# Altium schematic sheet Gate Drive.SchDoc
size 431 x 279 mm; Organization: ORGANIZATION; Address1: ADDRESS 1; Address2: ADDRESS 2; Address3: ADDRESS 3; Address4: ADDRESS 4; DocumentNumber: 1; SheetNumber: 2; SheetTotal: 6
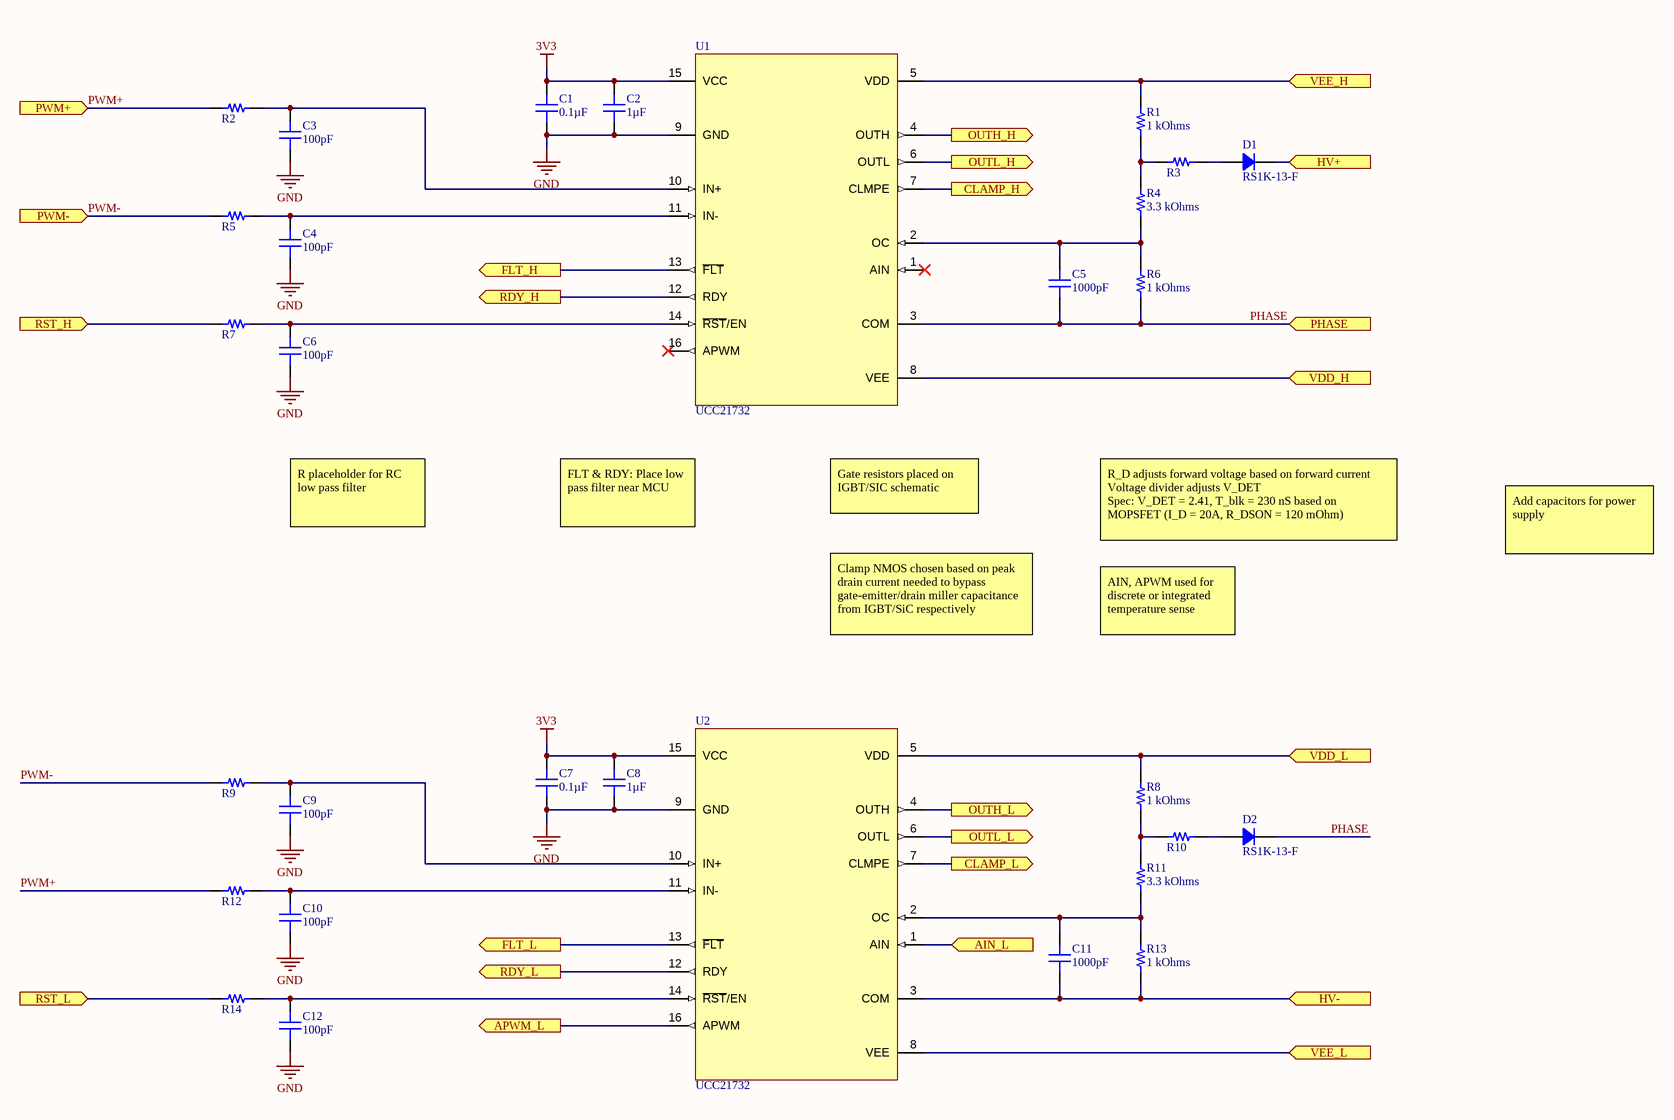
[diagram p0: Gate Drive.SchDoc]

## Parts
C1  0.1µF  [CAP 0805_2012]
C2  1µF  [CAP 0805_2012]
C3  100pF  [CAP 0805_2012]
C4  100pF  [CAP 0805_2012]
C5  1000pF  [CAP 0805_2012]
C6  100pF  [CAP 0805_2012]
C7  0.1µF  [CAP 0805_2012]
C8  1µF  [CAP 0805_2012]
C9  100pF  [CAP 0805_2012]
C10  100pF  [CAP 0805_2012]
C11  1000pF  [CAP 0805_2012]
C12  100pF  [CAP 0805_2012]
D1  RS1K-13-F  [DO214AC SMA]
D2  RS1K-13-F  [DO214AC SMA]
R1  1 kOhms  [RES 0805_2012]
R2  (no value)  [RES 0805_2012]
R3  (no value)  [RES 0805_2012]
R4  3.3 kOhms  [RES 0805_2012]
R5  (no value)  [RES 0805_2012]
R6  1 kOhms  [RES 0805_2012]
R7  (no value)  [RES 0805_2012]
R8  1 kOhms  [RES 0805_2012]
R9  (no value)  [RES 0805_2012]
R10  (no value)  [RES 0805_2012]
R11  3.3 kOhms  [RES 0805_2012]
R12  (no value)  [RES 0805_2012]
R13  1 kOhms  [RES 0805_2012]
R14  (no value)  [RES 0805_2012]
U1  UCC21732
U2  UCC21732

## Ports
AIN_L (in), APWM_L (out), CLAMP_H (out), CLAMP_L (out), FLT_H (out), FLT_L (out), HV+ (in), HV- (in), OUTH_H (out), OUTH_L (out), OUTL_H (out), OUTL_L (out), PHASE (in), PWM+ (in), PWM- (in), RDY_H (out), RDY_L (out), RST_H (in), RST_L (in), VDD_H (in), VDD_L (in), VEE_H (in), VEE_L (in)

## Nets
3V3: C1.2 C2.2 C7.2 C8.2 U1.15(VCC) U2.15(VCC)
GND: C1.1 C2.1 C3.1 C4.1 C6.1 C7.1 C8.1 C9.1 C10.1 C12.1 U1.9(GND) U2.9(GND)
AIN_L: U2.1(AIN) ; port AIN_L
APWM_L: U2.16(APWM) ; port APWM_L
CLAMP_H: U1.7(CLMPE) ; port CLAMP_H
CLAMP_L: U2.7(CLMPE) ; port CLAMP_L
FLT_H: U1.13(~{FLT}) ; port FLT_H
FLT_L: U2.13(~{FLT}) ; port FLT_L
HV+: D1.2 ; port HV+
HV-: C11.1 R13.1 U2.3(COM) ; port HV-
OUTH_H: U1.4(OUTH) ; port OUTH_H
OUTH_L: U2.4(OUTH) ; port OUTH_L
OUTL_H: U1.6(OUTL) ; port OUTL_H
OUTL_L: U2.6(OUTL) ; port OUTL_L
PHASE: C5.1 D2.2 R6.1 U1.3(COM) ; port PHASE
PWM+: R2.1 R12.1 ; port PWM+
PWM-: R5.1 R9.1 ; port PWM-
RDY_H: U1.12(RDY) ; port RDY_H
RDY_L: U2.12(RDY) ; port RDY_L
RST_H: R7.1 ; port RST_H
RST_L: R14.1 ; port RST_L
VDD_H: U1.8(VEE) ; port VDD_H
VDD_L: R8.2 U2.5(VDD) ; port VDD_L
VEE_H: R1.2 U1.5(VDD) ; port VEE_H
VEE_L: U2.8(VEE) ; port VEE_L
NetC3_2: C3.2 R2.2 U1.10(IN+)
NetC4_2: C4.2 R5.2 U1.11(IN-)
NetC5_2: C5.2 R4.1 R6.2 U1.2(OC)
NetC6_2: C6.2 R7.2 U1.14(~{RST}/EN)
NetC9_2: C9.2 R9.2 U2.10(IN+)
NetC10_2: C10.2 R12.2 U2.11(IN-)
NetC11_2: C11.2 R11.1 R13.2 U2.2(OC)
NetC12_2: C12.2 R14.2 U2.14(~{RST}/EN)
NetD1_1: D1.1 R3.2
NetD2_1: D2.1 R10.2
NetR1_1: R1.1 R3.1 R4.2
NetR8_1: R8.1 R10.1 R11.2

Not connected (* = marked no-connect by the designer): U1 1(AIN)* 16(APWM)*

## Notes on the sheet
- R placeholder for RC low pass filter
- FLT & RDY: Place low pass filter near MCU
- Gate resistors placed on IGBT/SIC schematic
- R_D adjusts forward voltage based on forward current
  Voltage divider adjusts V_DET
  Spec: V_DET = 2.41, T_blk = 230 nS based on MOPSFET (I_D = 20A, R_DSON = 120 mOhm)
- Add capacitors for power supply
- Clamp NMOS chosen based on peak drain current needed to bypass gate-emitter/drain miller capacitance from IGBT/SiC respectively
- AIN, APWM used for discrete or integrated temperature sense
- Title
- Project
- Scale
- Size
- B
- Part Number
- Engineer
- Sheet
- of
- Rev

## Library data of the parts
C1 C7 = CGA4J2X7R2A104K125AE: CAP CER 0.1UF 100V X7R 0805; Manufacturer: TDK Corporation; Tolerance: ±10%; Part Number: CGA4J2X7R2A104K125AE; Value: 0.1µF; Applications: Automotive, Boardflex Sensitive; Capacitance: 0.1µF; ComponentLink1Description: Datasheet; ComponentLink1URL: https://product.tdk.com/info/en/catalog/datasheets/mlcc_automotive_soft_en.pdf?ref_disty=digikey; ComponentLink2Description: DigiKey Link; ComponentLink2URL: http://digikey.com/product-detail/en/tdk-corporation/CGA4J2X7R2A104K125AE/445-15961-1-ND/4490669; Device Package: 0805 (2012 Metric); Features: Soft Termination; LastUpdated: 9/2/2020 1:04:19 AM; Lifecycle Status: Active; Minimum Order: 1; Mounting Type: Surface Mount, MLCC; Operating Temperature: -55°C ~ 125°C; Package / Case: 0805 (2012 Metric); Packaging: TapeAndReel; PartId: 14432; Part Status: Active; Price: 0.07; Ratings: AEC-Q200; Series: CGA; Size / Dimension: 0.079" L x 0.049" W (2.00mm x 1.25mm); Supplier 1: DigiKey; Supplier Part Number 1: 445-15961-1-ND; Temperature Coefficient: X7R; Thickness (Max): 0.057" (1.45mm); Voltage - Rated: 100V
C2 C8 = CGA4J3X7R1E105K125AD: CAP CER 1UF 25V X7R 0805 EPOXY; Manufacturer: TDK Corporation; Tolerance: ±10%; Part Number: CGA4J3X7R1E105K125AD; Value: 1µF; Applications: Automotive; Capacitance: 1µF; ComponentLink1Description: Datasheet; ComponentLink1URL: https://product.tdk.com/info/en/catalog/datasheets/mlcc_automotive_epoxy_en.pdf?ref_disty=digikey; ComponentLink2Description: DigiKey Link; ComponentLink2URL: http://digikey.com/product-detail/en/tdk-corporation/CGA4J3X7R1E105K125AD/445-8811-1-ND/3248259; Device Package: 0805 (2012 Metric); Features: Epoxy Mountable; LastUpdated: 9/2/2020 1:04:19 AM; Lifecycle Status: Active; Minimum Order: 1; Mounting Type: Surface Mount, MLCC, Epoxy; Operating Temperature: -55°C ~ 125°C; Package / Case: 0805 (2012 Metric); Packaging: TapeAndReel; PartId: 14482; Part Status: Active; Price: 0.09; Ratings: AEC-Q200; Series: CGA; Size / Dimension: 0.079" L x 0.049" W (2.00mm x 1.25mm); Supplier 1: DigiKey; Supplier Part Number 1: 445-8811-1-ND; Temperature Coefficient: X7R; Thickness (Max): 0.057" (1.45mm); Voltage - Rated: 25V
C3 C4 C6 C9 C10 C12 = C0805C101K3RAC7800: CAP CER 100PF 25V X7R 0805; Manufacturer: KEMET; Tolerance: ±10%; Part Number: C0805C101K3RAC7800; Value: 100pF; Applications: Bypass, Decoupling; Capacitance: 100pF; ComponentLink1Description: Datasheet; ComponentLink1URL: https://api.kemet.com/component-edge/download/datasheet/C0805C101K3RAC7800.pdf; ComponentLink2Description: DigiKey Link; ComponentLink2URL: http://digikey.com/product-detail/en/kemet/C0805C101K3RAC7800/399-15002-1-ND/7382551; Device Package: 0805 (2012 Metric); LastUpdated: 9/2/2020 1:04:39 AM; Lifecycle Status: Active; Minimum Order: 1; Mounting Type: Surface Mount, MLCC; Operating Temperature: -55°C ~ 125°C; Package / Case: 0805 (2012 Metric); Packaging: TapeAndReel; PartId: 3885; Part Status: Active; Price: 0.05; Series: SMD Comm X7R; Size / Dimension: 0.079" L x 0.049" W (2.00mm x 1.25mm); Supplier 1: DigiKey; Supplier Part Number 1: 399-15002-1-ND; Temperature Coefficient: X7R; Thickness (Max): 0.035" (0.88mm); Voltage - Rated: 25V
C5 C11 = C0805C102J5RACTU: CAP CER 1000PF 50V X7R 0805; Manufacturer: KEMET; Tolerance: ±5%; Part Number: C0805C102J5RACTU; Value: 1000pF; Applications: Bypass, Decoupling; Capacitance: 1000pF; ComponentLink1Description: Datasheet; ComponentLink1URL: https://api.kemet.com/component-edge/download/datasheet/C0805C102J5RACTU.pdf; ComponentLink2Description: DigiKey Link; ComponentLink2URL: http://digikey.com/product-detail/en/kemet/C0805C102J5RACTU/399-1149-1-ND/411424; Device Package: 0805 (2012 Metric); LastUpdated: 9/2/2020 1:04:42 AM; Lifecycle Status: Active; Minimum Order: 1; Mounting Type: Surface Mount, MLCC; Operating Temperature: -55°C ~ 125°C; Package / Case: 0805 (2012 Metric); Packaging: TapeAndReel; PartId: 2505; Part Status: Active; Price: 0.02; Series: SMD Comm X7R; Size / Dimension: 0.079" L x 0.049" W (2.00mm x 1.25mm); Supplier 1: DigiKey; Supplier Part Number 1: 399-1149-1-ND; Temperature Coefficient: X7R; Thickness (Max): 0.035" (0.88mm); Voltage - Rated: 50V
D1 D2 = RS1K-13-F: DIODE GEN PURP 800V 1A SMA; Manufacturer: Diodes Incorporated; Capacitance @ Vr, F: 15pF @ 4V, 1MHz; Current - Reverse Leakage @ Vr: 5µA @ 800V; Diode Type: Standard; Reverse Recovery Time (trr): 500ns; Speed: Fast Recovery =< 500ns, > 200mA (Io); Voltage - Forward (Vf) (Max) @ If: 1.3V @ 1A; Part Number: RS1K-13-F; ComponentLink1Description: Datasheet; ComponentLink1URL: https://www.diodes.com/assets/Datasheets/ds15002.pdf; ComponentLink2Description: DigiKey Link; ComponentLink2URL: http://digikey.com/product-detail/en/diodes-incorporated/RS1K-13-F/RS1K-FDICT-ND/750029; Current - Average Rectified (Io): 1A; LastUpdated: 9/2/2020 1:19:04 AM; Lifecycle Status: Active; Minimum Order: 1; Mounting Type: Surface Mount; Operating Temperature - Junction: -65°C ~ 150°C; Package / Case: DO-214AC, SMA; Packaging: TapeAndReel; PartId: 637; Part Status: Active; Price: 0.10; Series: -; Supplier 1: DigiKey; Supplier Part Number 1: RS1K-FDICT-ND; Supplier Device Package: SMA; Voltage - DC Reverse (Vr) (Max): 800V
R1 R6 R8 R13 = CRCW08051K00JNEAHP: RES SMD 1K OHM 5% 1/2W 0805; Manufacturer: Vishay Dale; Power (Watts): 0.5W, 1/2W; Temperature Coefficient: ±200ppm/°C; Part Number: CRCW08051K00JNEAHP; Value: 1 kOhms; ComponentLink1Description: Datasheet; ComponentLink1URL: http://www.vishay.com/docs/20043/crcwhpe3.pdf; ComponentLink2Description: DigiKey Link; ComponentLink2URL: http://digikey.com/product-detail/en/vishay-dale/CRCW08051K00JNEAHP/541-1.0KTACT-ND/2222900; Composition: Thick Film; Device Package: 0805 (2012 Metric); Features: Automotive AEC-Q200, Pulse Withstanding; Height - Seated (Max): 0.020" (0.50mm); LastUpdated: 9/2/2020 1:15:08 AM; Lifecycle Status: Active; Minimum Order: 1; Number of Terminations: 2; Operating Temperature: -55°C ~ 155°C; Package / Case: 0805 (2012 Metric); Packaging: TapeAndReel; PartId: 34827; Part Status: Active; Price: 0.02; Ratings: AEC-Q200; Resistance: 1 kOhms; Series: CRCW-HP; Size / Dimension: 0.079" L x 0.049" W (2.00mm x 1.25mm); Supplier 1: DigiKey; Supplier Part Number 1: 541-1.0KTACT-ND; Supplier Device Package: 0805; Tolerance: ±5%
R2 R3 R5 R7 R9 R10 R12 R14 = 5107: RES 0 OHM JUMPER 0805; Part Number: 5107; Manufacturer: Keystone Electronics; Power (Watts): 0.5W, 1/2W; ComponentLink1Description: Datasheet; ComponentLink1URL: http://www.keyelco.com/product-pdf.cfm?p=14350; ComponentLink2Description: DigiKey Link; ComponentLink2URL: http://digikey.com/product-detail/en/keystone-electronics/5107/36-5107CT-ND/7942984; Composition: Metal Element; Device Package: 0805 (2012 Metric); Height - Seated (Max): 0.033" (0.84mm); LastUpdated: 9/2/2020 1:14:45 AM; Lifecycle Status: Active; Minimum Order: 1; Number of Terminations: 2; Package / Case: 0805 (2012 Metric); Packaging: TapeAndReel; PartId: 45276; Part Status: Active; Price: 0.16; Series: -; Size / Dimension: 0.079" L x 0.049" W (2.00mm x 1.25mm); Supplier 1: DigiKey; Supplier Part Number 1: 36-5107CT-ND; Supplier Device Package: 0805; Tolerance: Jumper
R4 R11 = CRCW08053K30JNEA: RES SMD 3.3K OHM 5% 1/8W 0805; Manufacturer: Vishay Dale; Power (Watts): 0.125W, 1/8W; Temperature Coefficient: ±200ppm/°C; Part Number: CRCW08053K30JNEA; Value: 3.3 kOhms; ComponentLink1Description: Datasheet; ComponentLink1URL: http://www.vishay.com/docs/20035/dcrcwe3.pdf; ComponentLink2Description: DigiKey Link; ComponentLink2URL: http://digikey.com/product-detail/en/vishay-dale/CRCW08053K30JNEA/541-3.3KACT-ND/1180352; Composition: Thick Film; Device Package: 0805 (2012 Metric); Features: Automotive AEC-Q200; Height - Seated (Max): 0.020" (0.50mm); LastUpdated: 9/2/2020 1:14:52 AM; Lifecycle Status: Active; Minimum Order: 1; Number of Terminations: 2; Operating Temperature: -55°C ~ 155°C; Package / Case: 0805 (2012 Metric); Packaging: CutTape; PartId: 42029; Part Status: Active; Price: 0.10; Ratings: AEC-Q200; Resistance: 3.3 kOhms; Series: CRCW; Size / Dimension: 0.079" L x 0.049" W (2.00mm x 1.25mm); Supplier 1: DigiKey; Supplier Part Number 1: 541-3.3KACT-ND; Supplier Device Package: 0805; Tolerance: ±5%
U1 U2 = UCC21732: 10A Gate Driver Capacitive Coupling 5700Vrms 1 Channel 16-SOIC